# EAGLE design UV sensor  (EAGLE 9.6.2)
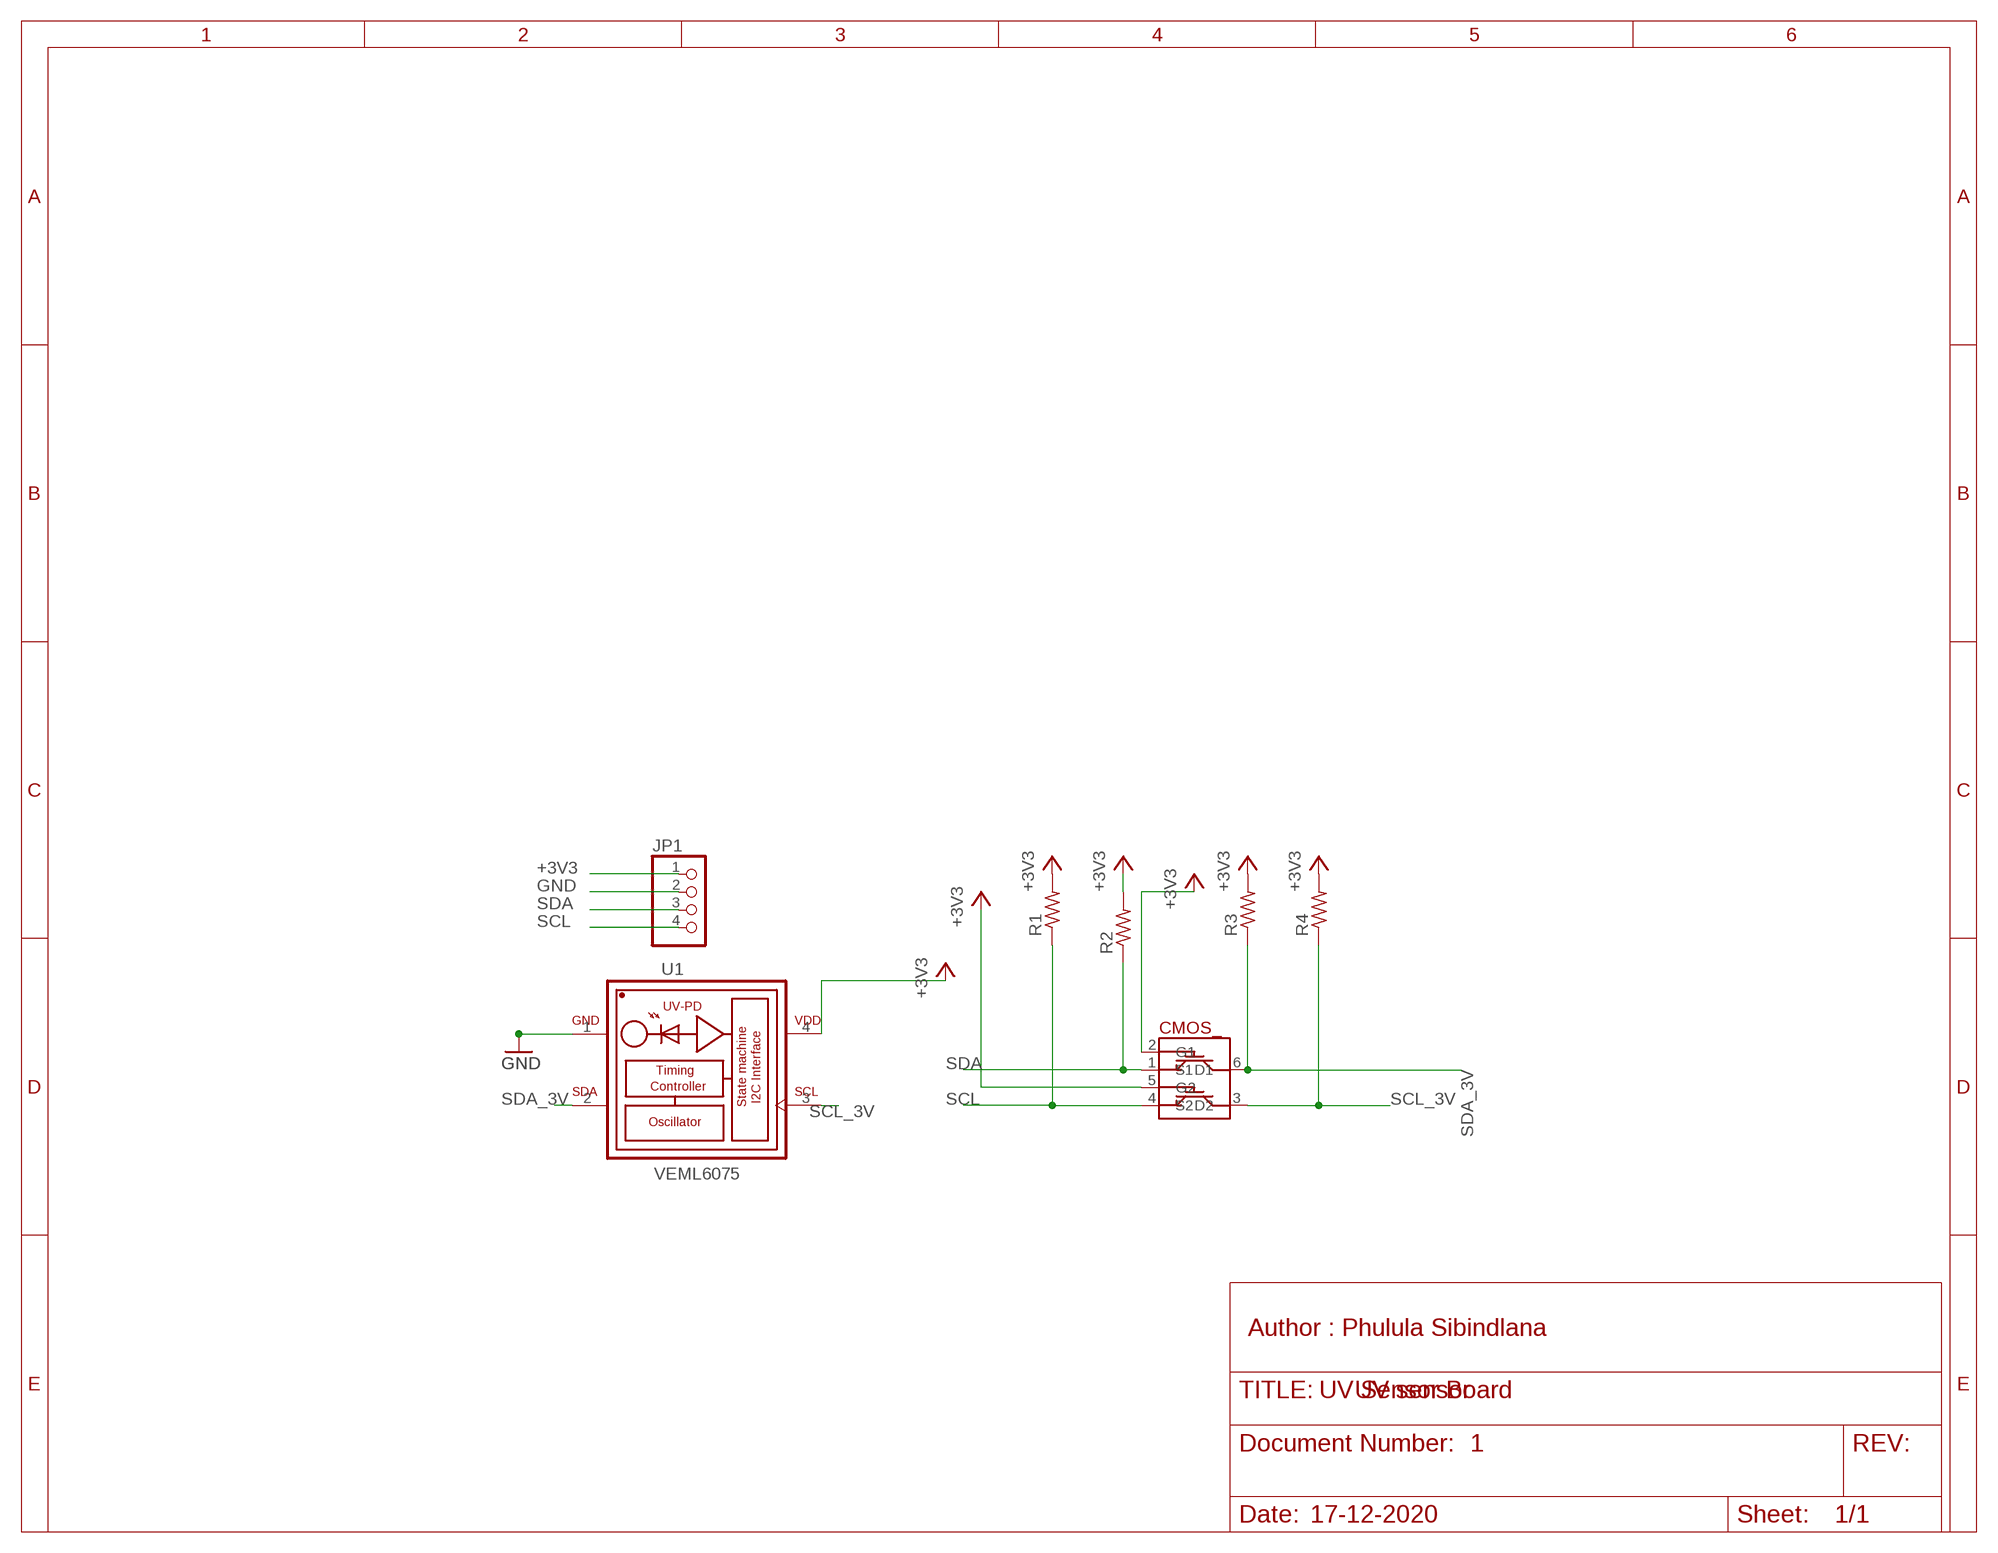
[diagram p0: schematic, sheet 1]

## Parts
JP1  PINHD-1X4  [1X04]
R1  R-US_R0603  [R0603]
R2  R-US_R0603  [R0603]
R3  R-US_R0603  [R0603]
R4  R-US_R0603  [R0603]
U1  VEML6075  [VISHAY_VEML6075_1.25X2X1]
U$1  2N7002DW  [SOT363]

## Nets
+3V3: JP1.1 R1.2 R2.2 R3.2 R4.2 U1.4(VDD) U$1.2(G1)
GND: JP1.2 U1.1(GND)
N$1: U$1.5(G2) ; supply symbol labelled +3V3
SCL: JP1.4 R1.1 U$1.4(S2)
SCL_3V: R4.1 U1.3(SCL) U$1.3(D2)
SDA: JP1.3 R2.1 U$1.1(S1)
SDA_3V: R3.1 U1.2(SDA) U$1.6(D1)

## Notes on the sheet
- Author : Phulula Sibindlana
- UV Sensor Board
- 1
- 17-12-2020

## Library data of the parts
JP1 = pinhead:PINHD-1X4: PIN HEADER
R1-R4 = rcl:R-US_: RESISTOR, American symbol; SPICEPREFIX: R
U1 = VEML6075:VEML6075: VEML6075 UVA and UVB Light Sensor with I2C Interface: The VEML6075 senses UVA and UVB light and incorporates photodiode, amplifiers, and analog / digital circuits into a single chip using a CMOS process. When the UV sensor is applied, it is able to detect UVA and UVB intensity to provide a measure of the signal strength as well as allowing for UVI measurement. Device Model created 15.06.2016 by Johannes Kolb - Vishay Semiconductor GmbH Check prices <https://pricing.snapeda.com/parts/VEML6075/Vishay%20Semiconductor/view-part?ref=eda>; AVAILABILITY: Bad; DESCRIPTION: Optical Sensor Ultraviolet (UV) 330nm, 365nm I²C 4-TFLGA; MF: Vishay Semiconductor; MP: VEML6075; PACKAGE: TFLGA-4 Vishay; PRICE: None
U$1 = 2N7002DW:2N7002DW: Check prices <https://pricing.snapeda.com/parts/2N7002DW/ON%20Semiconductor/view-part?ref=eda>; AVAILABILITY: Good; DESCRIPTION: Mosfet Array 2 N-Channel (Dual) 60V 115mA 200mW Surface Mount SC-88 (SC-70-6); MF: ON Semiconductor; MP: 2N7002DW; PACKAGE: SOT-363 ON Semiconductor; PRICE: None; PURCHASE-URL: https://pricing.snapeda.com/search/part/2N7002DW/?ref=eda

## Board
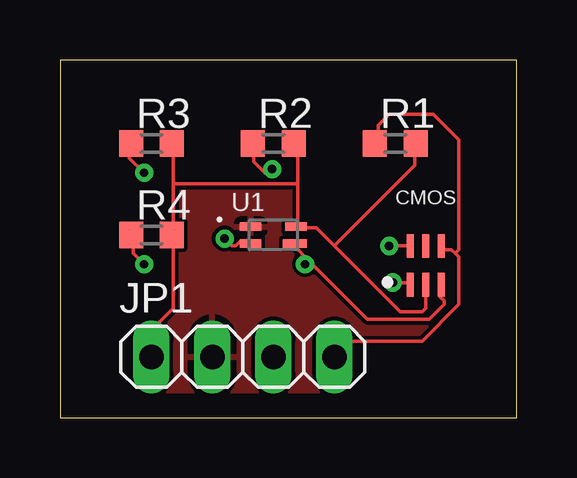
[diagram p1: board, top side]
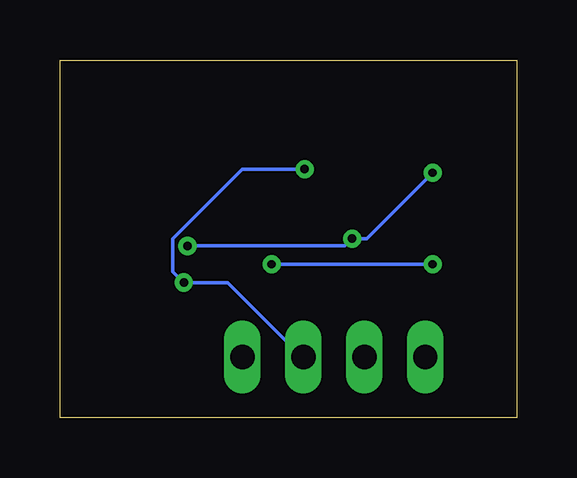
[diagram p2: board, bottom side, seen from below]

Size 19.03 x 14.91 mm. Coordinates in mm from the lower left corner, seen from the top.
Outline: 0,0 19.03,0 19.03,14.91 0,14.91 0,0
Copper layers (1*16): Top 0.035mm / dielectric 1.5mm / Bottom 0.035mm
Design rules "default": minimum track width 6mil, minimum drill 0.35mm, track to track 6mil, track to pad 6mil, pad to pad 6mil, via to via 6mil, smd to smd 6mil, copper to edge 40mil, drill to drill 6mil, minimum pad ring 10mil, minimum via ring 8mil, stop-mask expansion 4mil, vias tented up to drill 0mil, thermal gap 10mil

### Footprints (pad centres in the part's own frame; a part is rotated, then mirrored left to right if it is on the bottom)
1X04 = drill 1.016 long: 1 -3.81,0; 2 -1.27,0; 3 1.27,0; 4 3.81,0
R0603 = smd 1 x 1.1: 1 -0.85,0; 2 0.85,0
VISHAY_VEML6075_1.25X2X1 = smd 0.9 x 0.35: 1 -0.95,0.35; 2 -0.95,-0.35; 4 0.95,0.35 | smd 1 x 0.35: 3 0.9,-0.35
SOT363 = smd 0.3 x 0.99: 1 -0.65,-0.8; 2 0,-0.8; 3 0.65,-0.8; 4 0.65,0.81; 5 0,0.81; 6 -0.65,0.81

### Placement (x,y rotation side)
JP1  7.62,2.54 0 top
R1  13.97,11.43 0 top
R2  8.89,11.43 0 top
R3  3.81,11.43 0 top
R4  3.81,7.62 0 top
U1  8.89,7.62 0 top
U$1  15.24,6.35 0 top

### Tracks (layer width: path | path; a pad name or v marks a point on that pad's centre or on a via)
+3V3
  Top 0.152: 9.91,9.75 9.91,11.28 9.75,11.43 R2.2 | 9.91,9.75 9.91,8.08 U1.4 9.91,7.92 10.67,7.92 11.43,7.16 | U$1.2 15.24,4.57 15.09,4.42 14.17,4.42 11.43,7.16 | 11.43,7.16 14.78,10.52 14.78,11.43 R1.2 | 4.72,9.75 4.72,11.43 R3.2 | 4.72,9.75 4.72,7.62 | 4.72,7.62 4.72,4.57 3.81,3.66 JP1.1 | 4.72,7.62 R4.2 | 4.72,9.75 9.91,9.75
GND
  pour Top: 0,15.24 19.05,15.24 19.05,0 0,0
SCL
  Top 0.152: 16.46,6.86 16.61,6.71 16.61,4.72 15.09,3.2 12.04,3.2 11.43,2.59 JP1.4 | 16.46,6.86 16.31,7.01 16,7.01 U$1.4 | 16.46,6.86 16.61,7.01 16.61,11.58 15.54,12.65 13.72,12.65 13.26,12.19 13.26,11.43 R1.1
SCL_3V  (via drill 0.35)
  Top 0.152: 10.36,6.55 9.75,7.16 U1.3 | 10.36,6.55 12.8,4.12 15.39,4.12 16,4.72 16,4.88 15.85,5.03 15.85,5.49 U$1.3 | v3.5,6.4 3.05,6.86 3.05,7.62 R4.1 | 10.36,6.55 v10.21,6.4
  Bottom 0.152: v10.21,6.4 v3.5,6.4
SDA  (via drill 0.35)
  Top 0.152: v13.87,5.64 14.48,5.64 U$1.1 | v8.84,10.36 8.69,10.21 8.53,10.21 8.08,10.67 8.08,11.43 R2.1
  Bottom 0.152: JP1.3 8.99,2.59 12.04,5.64 v13.87,5.64 14.33,6.1 14.33,7.47 11.43,10.36 v8.84,10.36
SDA_3V  (via drill 0.35)
  Top 0.152: v6.86,7.47 7.16,7.16 7.32,7.16 7.47,7.32 7.92,7.32 U1.2 | v3.5,10.21 2.9,10.82 2.9,11.43 R3.1 | v13.72,7.16 14.48,7.16 U$1.6
  Bottom 0.152: v3.5,10.21 6.25,7.47 v6.86,7.47 7.16,7.16 v13.72,7.16

### Text on the board
Pads: UV sensor